# Altium schematic sheet AMU-S30-V00-AMSMaster.SchDoc
size A4; SheetNumber: 9; SheetTotal: 18
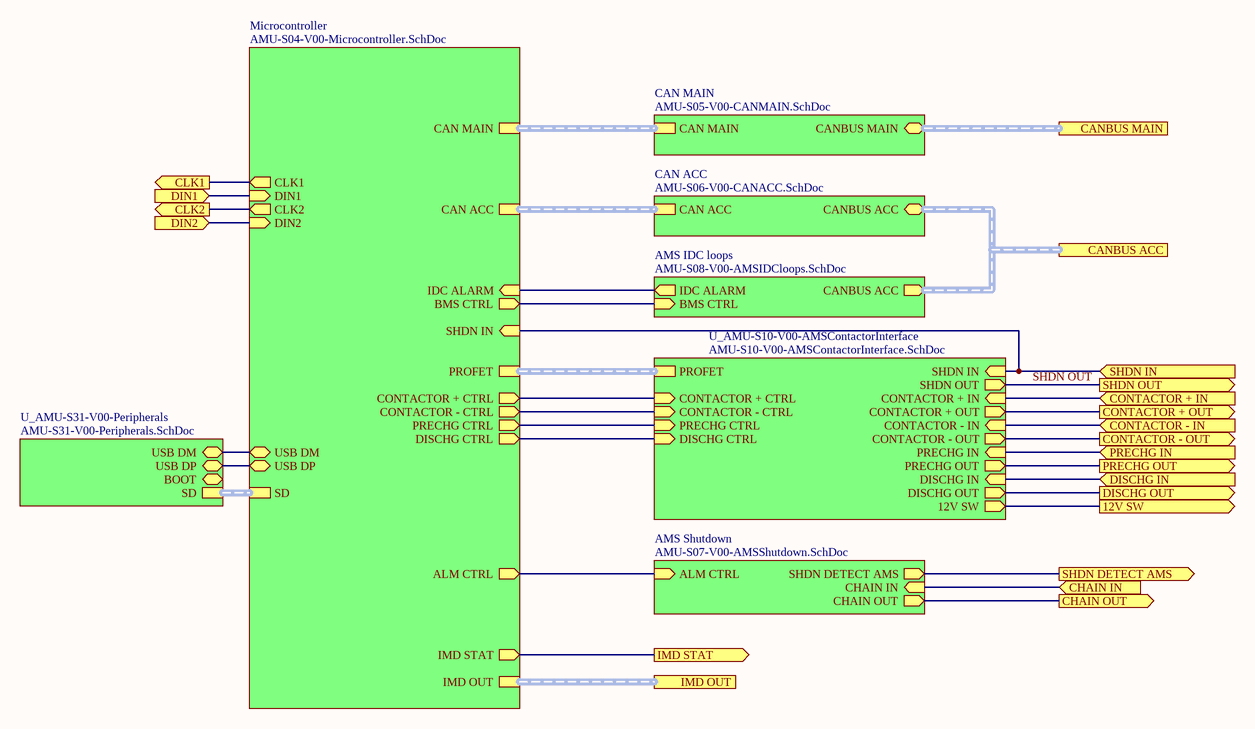
[diagram p0: AMU-S30-V00-AMSMaster.SchDoc]

## Sub-sheets
AMS IDC loops = AMU-S08-V00-AMSIDCloops.SchDoc: IDC ALARM (out), BMS CTRL (in), CANBUS ACC (out, harness CANBUS4)
AMS Shutdown = AMU-S07-V00-AMSShutdown.SchDoc: ALM CTRL (in), CHAIN OUT (out), CHAIN IN (in), SHDN DETECT AMS (out)
CAN ACC = AMU-S06-V00-CANACC.SchDoc: CANBUS ACC (bidir, harness CANBUS4), CAN ACC (harness CAN4)
CAN MAIN = AMU-S05-V00-CANMAIN.SchDoc: CANBUS MAIN (bidir, harness CANBUS MAIN), CAN MAIN (harness CAN MAIN)
Microcontroller = AMU-S04-V00-Microcontroller.SchDoc: CAN MAIN (harness CAN MAIN), CAN ACC (harness CAN ACC), ALM CTRL (out), IDC ALARM (in), BMS CTRL (out), IMD OUT (harness IMD OUT), PROFET (harness PROFET), PRECHG CTRL (out), DISCHG CTRL (out), CONTACTOR - CTRL (out), CONTACTOR + CTRL (out), IMD STAT (out), SD (harness SD), SHDN IN (in), USB DM (bidir), USB DP (bidir), CLK1 (out), DIN1 (in), CLK2 (out), DIN2 (in)
U_AMU-S10-V00-AMSContactorInterface = AMU-S10-V00-AMSContactorInterface.SchDoc: PROFET (harness PROFET), SHDN OUT (out), CONTACTOR + CTRL (in), SHDN IN (in), CONTACTOR + OUT (out), CONTACTOR + IN (in), CONTACTOR - OUT (out), CONTACTOR - IN (in), CONTACTOR - CTRL (in), PRECHG CTRL (in), PRECHG OUT (out), PRECHG IN (in), DISCHG OUT (out), DISCHG IN (in), DISCHG CTRL (in), 12V SW (out)
U_AMU-S31-V00-Peripherals = AMU-S31-V00-Peripherals.SchDoc: SD (harness SD), USB DP (bidir), BOOT (bidir), USB DM (bidir)

## Ports
12V SW (out), CANBUS ACC (harness USB-C), CANBUS MAIN (harness USB-C), CHAIN IN (in), CHAIN OUT (out), CLK1 (out), CLK2 (out), CONTACTOR + IN (in), CONTACTOR + OUT (out), CONTACTOR - IN (in), CONTACTOR - OUT (out), DIN1 (in), DIN2 (in), DISCHG IN (in), DISCHG OUT (out), IMD OUT (harness USB-C), IMD STAT (out), PRECHG IN (in), PRECHG OUT (out), SHDN DETECT AMS (out), SHDN IN (in), SHDN OUT (out)

## Nets
12V SW: port 12V SW, sheet U_AMU-S10-V00-AMSContactorInterface/12V SW
CHAIN IN: port CHAIN IN, sheet AMS Shutdown/CHAIN IN
CHAIN OUT: port CHAIN OUT, sheet AMS Shutdown/CHAIN OUT
CLK1: port CLK1, sheet Microcontroller/CLK1
CLK2: port CLK2, sheet Microcontroller/CLK2
CONTACTOR + IN: port CONTACTOR + IN, sheet U_AMU-S10-V00-AMSContactorInterface/CONTACTOR + IN
CONTACTOR + OUT: port CONTACTOR + OUT, sheet U_AMU-S10-V00-AMSContactorInterface/CONTACTOR + OUT
CONTACTOR - IN: port CONTACTOR - IN, sheet U_AMU-S10-V00-AMSContactorInterface/CONTACTOR - IN
CONTACTOR - OUT: port CONTACTOR - OUT, sheet U_AMU-S10-V00-AMSContactorInterface/CONTACTOR - OUT
DIN1: port DIN1, sheet Microcontroller/DIN1
DIN2: port DIN2, sheet Microcontroller/DIN2
DISCHG IN: port DISCHG IN, sheet U_AMU-S10-V00-AMSContactorInterface/DISCHG IN
DISCHG OUT: port DISCHG OUT, sheet U_AMU-S10-V00-AMSContactorInterface/DISCHG OUT
IMD STAT: port IMD STAT, sheet Microcontroller/IMD STAT
PRECHG IN: port PRECHG IN, sheet U_AMU-S10-V00-AMSContactorInterface/PRECHG IN
PRECHG OUT: port PRECHG OUT, sheet U_AMU-S10-V00-AMSContactorInterface/PRECHG OUT
SHDN DETECT AMS: port SHDN DETECT AMS, sheet AMS Shutdown/SHDN DETECT AMS
SHDN IN: port SHDN IN, sheet Microcontroller/SHDN IN, sheet U_AMU-S10-V00-AMSContactorInterface/SHDN IN
SHDN OUT: port SHDN OUT, sheet U_AMU-S10-V00-AMSContactorInterface/SHDN OUT
(unnamed): sheet Microcontroller/ALM CTRL, sheet AMS Shutdown/ALM CTRL
(unnamed): sheet Microcontroller/IDC ALARM, sheet AMS IDC loops/IDC ALARM
(unnamed): sheet Microcontroller/BMS CTRL, sheet AMS IDC loops/BMS CTRL
(unnamed): sheet Microcontroller/PRECHG CTRL, sheet U_AMU-S10-V00-AMSContactorInterface/PRECHG CTRL
(unnamed): sheet Microcontroller/DISCHG CTRL, sheet U_AMU-S10-V00-AMSContactorInterface/DISCHG CTRL
(unnamed): sheet Microcontroller/CONTACTOR - CTRL, sheet U_AMU-S10-V00-AMSContactorInterface/CONTACTOR - CTRL
(unnamed): sheet Microcontroller/CONTACTOR + CTRL, sheet U_AMU-S10-V00-AMSContactorInterface/CONTACTOR + CTRL
(unnamed): sheet Microcontroller/USB DM, sheet U_AMU-S31-V00-Peripherals/USB DM
(unnamed): sheet Microcontroller/USB DP, sheet U_AMU-S31-V00-Peripherals/USB DP

## Buses and harness runs
harness port CANBUS ACC = sheet AMS IDC loops/CANBUS ACC = sheet CAN ACC/CANBUS ACC
harness port CANBUS MAIN = sheet CAN MAIN/CANBUS MAIN
harness port IMD OUT = sheet Microcontroller/IMD OUT
harness sheet CAN ACC/CAN ACC = sheet Microcontroller/CAN ACC
harness sheet CAN MAIN/CAN MAIN = sheet Microcontroller/CAN MAIN
harness sheet Microcontroller/PROFET = sheet U_AMU-S10-V00-AMSContactorInterface/PROFET
harness sheet Microcontroller/SD = sheet U_AMU-S31-V00-Peripherals/SD